# Altium schematic sheet Solar Panel.SchDoc
size A4
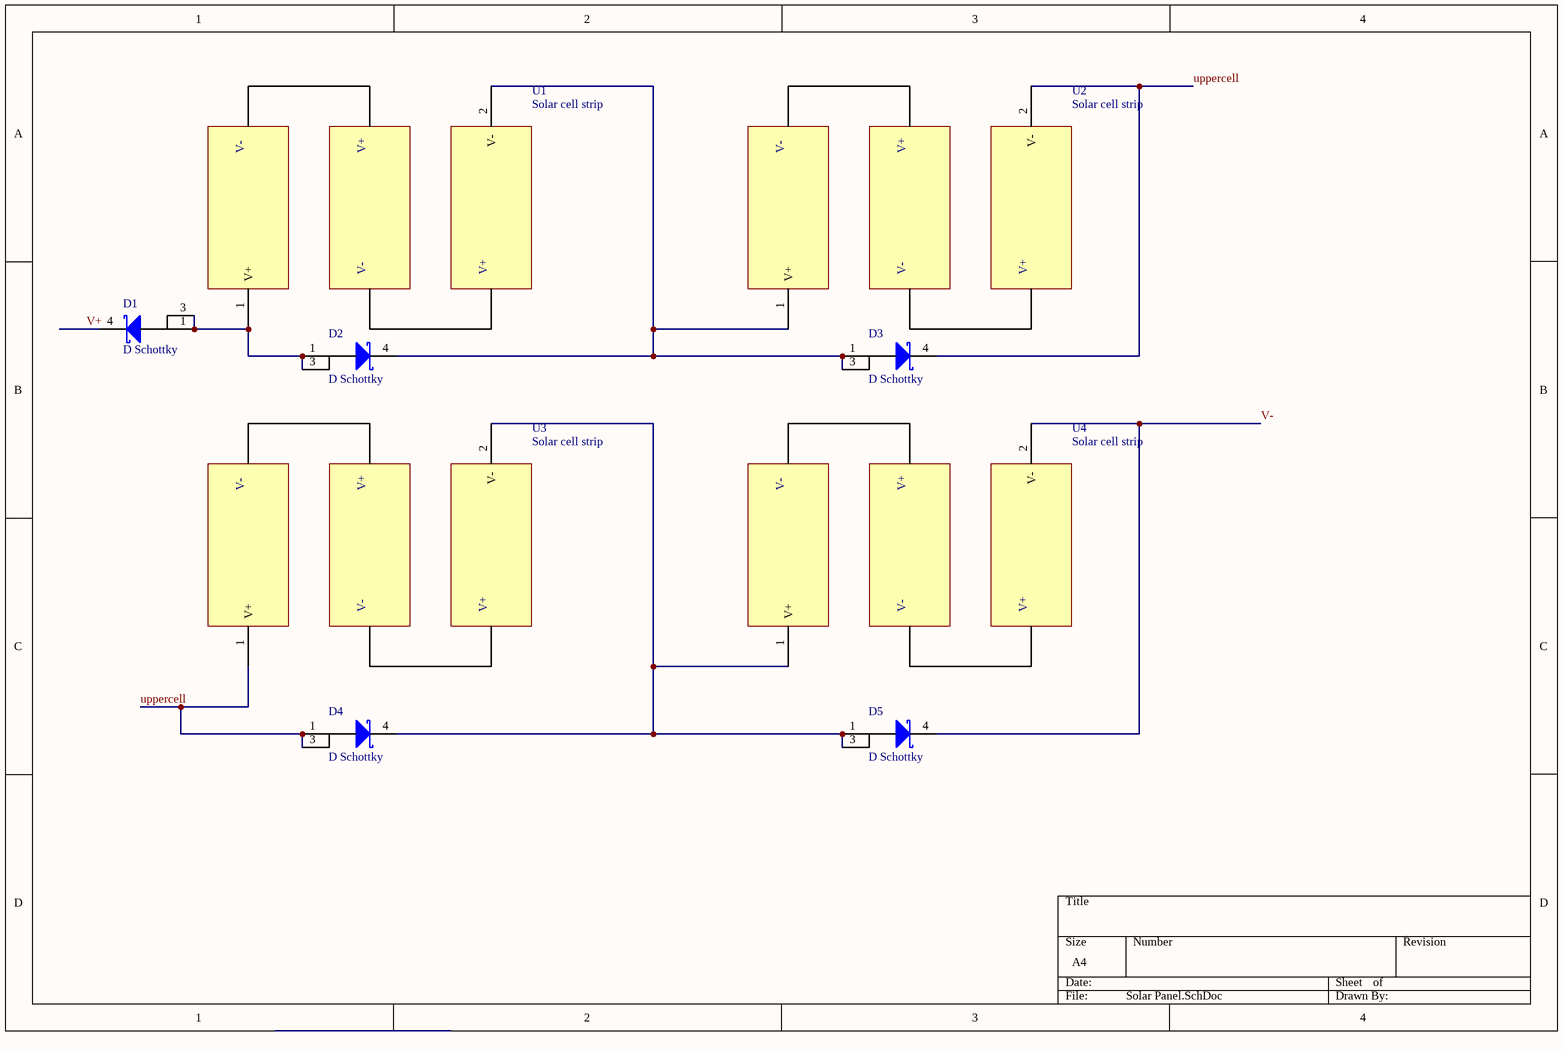
[diagram p0: Solar Panel.SchDoc]

## Parts
D1  D Schottky  [DIODE, SCHOTTKY, DPAK]
D2  D Schottky  [DIODE, SCHOTTKY, DPAK]
D3  D Schottky  [DIODE, SCHOTTKY, DPAK]
D4  D Schottky  [DIODE, SCHOTTKY, DPAK]
D5  D Schottky  [DIODE, SCHOTTKY, DPAK]
U1  Solar cell strip  [SOLARCELLSTRIP]
U2  Solar cell strip  [SOLARCELLSTRIP]
U3  Solar cell strip  [SOLARCELLSTRIP]
U4  Solar cell strip  [SOLARCELLSTRIP]

## Nets
uppercell: D3.4(K) D4.1(A) D4.3(A) U2.2(V-) U3.1(V+)
V+: D1.4(K)
V-: D5.4(K) U4.2(V-)
NetD1_1: D1.1(A) D1.3(A) D2.1(A) D2.3(A) U1.1(V+)
NetD2_4: D2.4(K) D3.1(A) D3.3(A) U1.2(V-) U2.1(V+)
NetD4_4: D4.4(K) D5.1(A) D5.3(A) U3.2(V-) U4.1(V+)

## Library data of the parts
D1-D5 = D Schottky: Schottky Diode; Published: 8-Jun-2000; LatestRevisionDate: 17-Jul-2002; LatestRevisionNote: Re-released for DXP Platform.; PackageReference: SMB; Publisher: Altium Limited; PackageDescription: DO-214-AA/SMB; 2 C-Bend Leads; Body 5.3 x 3.6 mm, inc. leads (LxW); Code_JEDEC: DO-214-AA